# Altium project radioboard.PrjPcb (part 3 of 3)

## Sheet STM32_microcontroller_RF.SchDoc: STM32 microcontroller RF
size A3; Date: Not used; ApprovedBy: Not used; CheckedBy: Not used; Author: Not used; CompanyName: STMicroelectronics; DrawnBy: Not used; Engineer: Not used; Organization: Not used; Address1: Not used; Address2: Not used; Address3: Not used; Address4: Not used; DocumentNumber: 5; Revision: Not used; SheetNumber: 5; SheetTotal: 8; CurrentTime: Not used; CurrentDate: Not used; Time: Not used; DocumentFullPathAndName: Not used; DocumentName: Not used; ModifiedDate: Not used; ImagePath: Not used; ProjectName: Not used; Application_BuildNumber: Not used
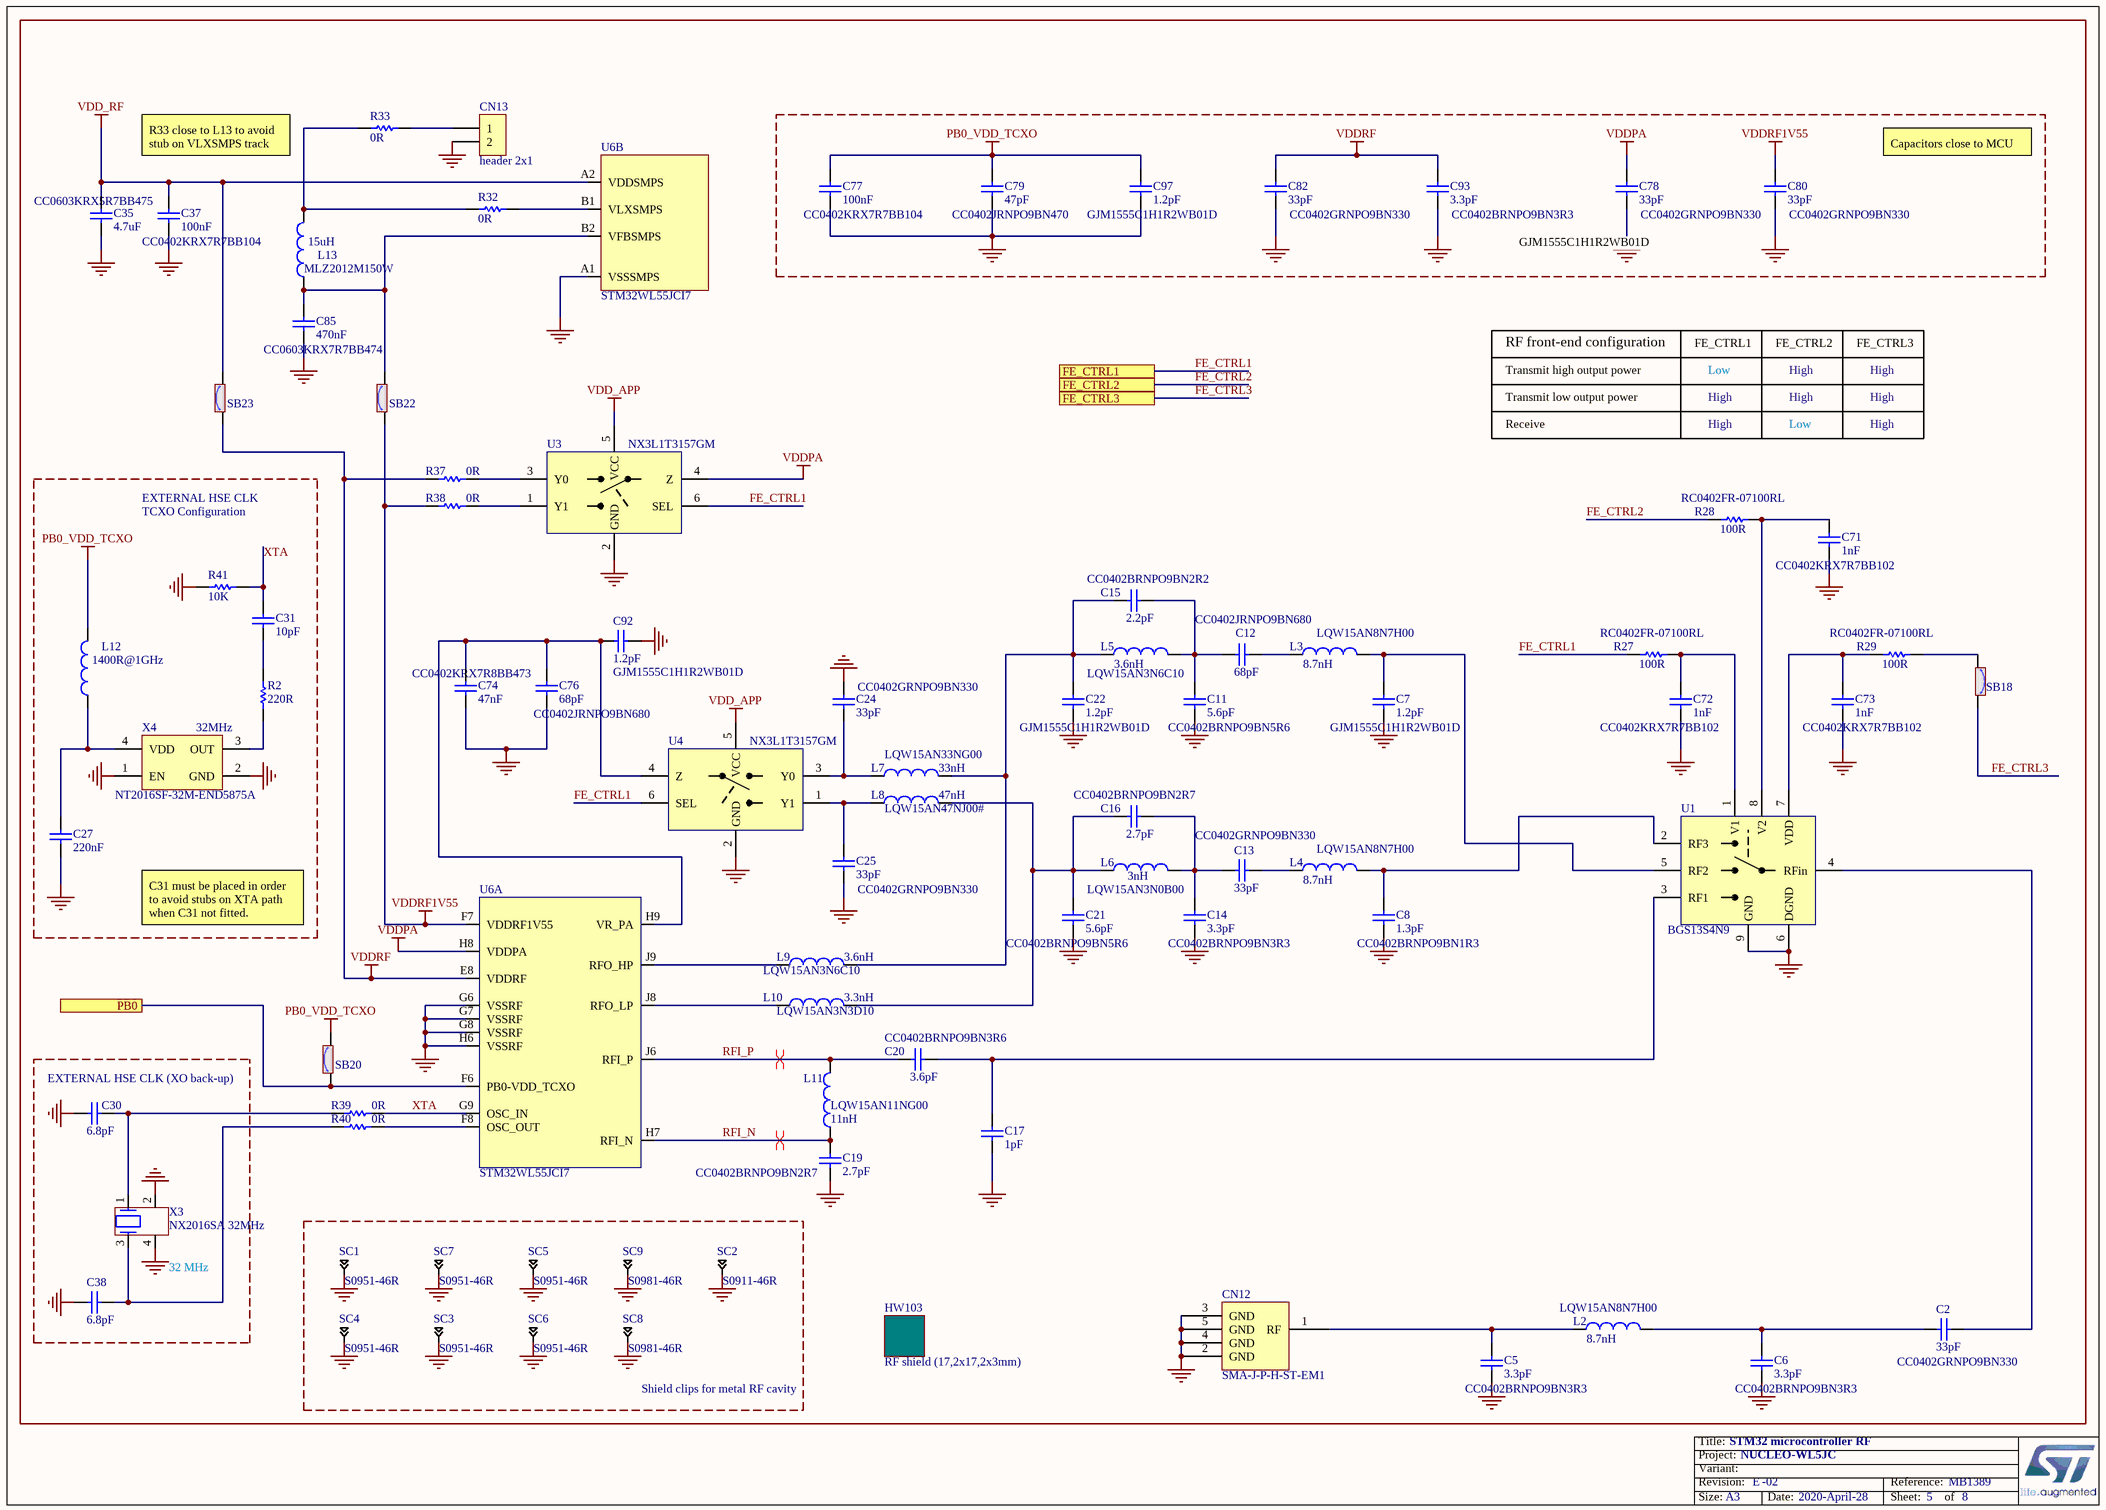
[diagram p6: STM32_microcontroller_RF.SchDoc]

### Parts
C2  value 33pF  Manufacturer_Part_Number: CC0402GRNPO9BN330  [C0402]
C5  value 3.3pF  Manufacturer_Part_Number: CC0402BRNPO9BN3R3  [C0402]
C6  value 3.3pF  Manufacturer_Part_Number: CC0402BRNPO9BN3R3  [C0402]
C7  value 1.2pF  Manufacturer_Part_Number: GJM1555C1H1R2WB01D  [C0402]  (hidden comment: Capacitor)
C8  value 1.3pF  Manufacturer_Part_Number: CC0402BRNPO9BN1R3  [C0402]
C11  value 5.6pF  Manufacturer_Part_Number: CC0402BRNPO9BN5R6  [C0402]  (hidden comment: Capacitor)
C12  value 68pF  Manufacturer_Part_Number: CC0402JRNPO9BN680  [C0402]  (hidden comment: Capacitor)
C13  value 33pF  Manufacturer_Part_Number: CC0402GRNPO9BN330  [C0402]
C14  value 3.3pF  Manufacturer_Part_Number: CC0402BRNPO9BN3R3  [C0402]
C15  value 2.2pF  Manufacturer_Part_Number: CC0402BRNPO9BN2R2  [C0402]  (hidden comment: Capacitor)
C16  value 2.7pF  Manufacturer_Part_Number: CC0402BRNPO9BN2R7  [C0402]
C17  value 1pF  [C0402]  (hidden comment: Capacitor)
C19  value 2.7pF  Manufacturer_Part_Number: CC0402BRNPO9BN2R7  [C0402]
C20  value 3.6pF  Manufacturer_Part_Number: CC0402BRNPO9BN3R6  [C0402]
C21  value 5.6pF  Manufacturer_Part_Number: CC0402BRNPO9BN5R6  [C0402]
C22  value 1.2pF  Manufacturer_Part_Number: GJM1555C1H1R2WB01D  [C0402]  (hidden comment: Capacitor)
C24  value 33pF  Manufacturer_Part_Number: CC0402GRNPO9BN330  [C0402]
C25  value 33pF  Manufacturer_Part_Number: CC0402GRNPO9BN330  [C0402]
C27  value 220nF  [C0402]  (hidden comment: Capacitor)
C30  value 6.8pF  [C0402]
C31  value 10pF  [C0402]  (hidden comment: Capacitor)
C35  value 4.7uF  Manufacturer_Part_Number: CC0603KRX5R7BB475  [C0603]
C37  value 100nF  Manufacturer_Part_Number: CC0402KRX7R7BB104  [C0402]
C38  value 6.8pF  [C0402]
C71  value 1nF  Manufacturer_Part_Number: CC0402KRX7R7BB102  [C0402]
C72  value 1nF  Manufacturer_Part_Number: CC0402KRX7R7BB102  [C0402]
C73  value 1nF  Manufacturer_Part_Number: CC0402KRX7R7BB102  [C0402]
C74  value 47nF  Manufacturer_Part_Number: CC0402KRX7R8BB473  [C0402]
C76  value 68pF  Manufacturer_Part_Number: CC0402JRNPO9BN680  [C0402]
C77  value 100nF  Manufacturer_Part_Number: CC0402KRX7R7BB104  [C0402]
C78  value 33pF  Manufacturer_Part_Number: CC0402GRNPO9BN330  [C0402]
C79  value 47pF  Manufacturer_Part_Number: CC0402JRNPO9BN470  [C0402]
C80  value 33pF  Manufacturer_Part_Number: CC0402GRNPO9BN330  [C0402]
C82  value 33pF  Manufacturer_Part_Number: CC0402GRNPO9BN330  [C0402]
C85  value 470nF  Manufacturer_Part_Number: CC0603KRX7R7BB474  [C0603]
C92  value 1.2pF  Manufacturer_Part_Number: GJM1555C1H1R2WB01D  [C0402]  (hidden comment: Capacitor)
C93  value 3.3pF  Manufacturer_Part_Number: CC0402BRNPO9BN3R3  [C0402]  (hidden comment: Capacitor)
C97  value 1.2pF  Manufacturer_Part_Number: GJM1555C1H1R2WB01D  [C0402]  (hidden comment: Capacitor)
CN12  value SMA-J-P-H-ST-EM1  [CON_SAMTEC_SMA-J-P-X-ST-EM1]
CN13  value header 2x1  [CON_988-JIUBABA_PHFS25-11-02-G0B115-T-1]
HW103  value RF shield (17,2x17,2x3mm)  [SHIELD_RF_ST-CUSTOM_17P2X17P2_H3]  (hidden comment: Daughter_Board)
L2  value 8.7nH  Manufacturer_Part_Number: LQW15AN8N7H00  [IND_0402_MURATA_LQW15AN_H0P5]
L3  value 8.7nH  Manufacturer_Part_Number: LQW15AN8N7H00  [IND_0402_MURATA_LQW15AN_H0P5]  (hidden comment: Inductor)
L4  value 8.7nH  Manufacturer_Part_Number: LQW15AN8N7H00  [IND_0402_MURATA_LQW15AN_H0P5]
L5  value 3.6nH  Manufacturer_Part_Number: LQW15AN3N6C10  [IND_0402_MURATA_LQW15AN_H0P5]  (hidden comment: Inductor)
L6  value 3nH  Manufacturer_Part_Number: LQW15AN3N0B00  [IND_0402_MURATA_LQW15AN_H0P5]  (hidden comment: Inductor)
L7  value 33nH  Manufacturer_Part_Number: LQW15AN33NG00  [IND_0402_MURATA_LQW15AN_H0P5]  (hidden comment: Inductor)
L8  value 47nH  Manufacturer_Part_Number: LQW15AN47NJ00#  [IND_0402_MURATA_LQW15AN2N4C00X]
L9  value 3.6nH  Manufacturer_Part_Number: LQW15AN3N6C10  [IND_0402_MURATA_LQW15AN_H0P5]
L10  value 3.3nH  Manufacturer_Part_Number: LQW15AN3N3D10  [IND_0402_MURATA_LQW15AN_H0P5]
L11  value 11nH  Manufacturer_Part_Number: LQW15AN11NG00  [IND_0402_MURATA_LQW15AN_H0P5]  (hidden comment: Inductor)
L12  value 1400R@1GHz  [IND_0402_MURATA_BLM15H_H0P5]
L13  value 15uH  Manufacturer_Part_Number: MLZ2012M150W  [IND_TDK_MLZ2012M150W]
R2  value 220R  [R0402]  (hidden comment: Resistor)
R27  value 100R  Manufacturer_Part_Number: RC0402FR-07100RL  [R0402]
R28  value 100R  Manufacturer_Part_Number: RC0402FR-07100RL  [R0402]
R29  value 100R  Manufacturer_Part_Number: RC0402FR-07100RL  [R0402]
R32  value 0R  [R0402]
R33  value 0R  [R0402]
R37  value 0R  [R0402]
R38  value 0R  [R0402]
R39  value 0R  [R0402]
R40  value 0R  [R0402]
R41  value 10K  [R0402]
SB18  (no value)  [SOLDER-BRIDGE_R0603-0R]
SB20  (no value)  [SOLDER-BRIDGE_R0603-0R]
SB22  (no value)  [SOLDER-BRIDGE_R0603-0R]
SB23  (no value)  [SOLDER-BRIDGE_R0603-0R]
SC1  value S0951-46R  [CLIP_HARWIN_S0951-46R]
SC2  value S0911-46R  (hidden comment: Shield-clip_S0951-46R)
SC3  value S0951-46R  [CLIP_HARWIN_S0951-46R]
SC4  value S0951-46R  [CLIP_HARWIN_S0951-46R]
SC5  value S0951-46R  [CLIP_HARWIN_S0951-46R]
SC6  value S0951-46R  [CLIP_HARWIN_S0951-46R]
SC7  value S0951-46R  [CLIP_HARWIN_S0951-46R]
SC8  value S0981-46R  (hidden comment: Shield-clip_S0981-46R)
SC9  value S0981-46R  (hidden comment: Shield-clip_S0981-46R)
U1  value BGS13S4N9  [ICC_TSNP-9-3_1P1X1P1_P040]
U3  value NX3L1T3157GM  [ICC_SOT886_XSON6]
U4  value NX3L1T3157GM  [ICC_SOT886_XSON6]
U6  value STM32WL55JCI7  [ICC_UFBGA73_5X5_P050]  (parts A,B of 5)
X3  value NX2016SA 32MHz  [CRY_NX2016SA_4P]
X4  value 32MHz  [CRY_NDK_NT2016SB_4P]  (hidden comment: NT2016SF)

### Blocks framed on the sheet
Shield clips for metal RF cavity: SC1-SC9

### Ports
FE_CTRL1, FE_CTRL2, FE_CTRL3, PB0

### Nets
GND: C5.1 C6.1 C7.1 C8.1 C11.1 C14.1 C17.1 C19.1 C21.1 C22.1 C24.2 C25.1 C27.1 C30.1 C35.1 C37.2 C38.1 C71.1 C72.1 C73.1 C74.1 C76.1 C77.2 C78.1 C79.1 C80.1 C82.1 C85.1 C92.1 C93.1 C97.1 CN12.2(GND) CN12.3(GND) CN12.4(GND) CN12.5(GND) CN13.2 R41.1 SC1.1 SC2.1 SC3.1 SC4.1 SC5.1 SC6.1 SC7.1 SC8.1 SC9.1 U1.6(DGND) U1.9(GND) U3.2(GND) U4.2(GND) U6.A1(VSSSMPS) U6.G6(VSSRF) U6.G7(VSSRF) U6.G8(VSSRF) U6.H6(VSSRF) X3.2 X3.4 X4.1(EN) X4.2(GND)
PB0_VDD_TCXO: C77.1 C79.2 C97.2 L12.2 SB20.2
VDD_APP: U3.5(VCC) U4.5(VCC)
VDD_RF: C35.2 C37.1 SB23.2 U6.A2(VDDSMPS)
VDDPA: C78.2 U3.4(Z) U6.H8(VDDPA)
VDDRF: C82.2 C93.2 R37.2 SB23.1 U6.E8(VDDRF)
VDDRF1V55: C80.2 R38.2 SB22.1 U6.F7(VDDRF1V55)
FE_CTRL1: R27.1 U3.6(SEL) U4.6(SEL) ; port FE_CTRL1
FE_CTRL2: R28.1 ; port FE_CTRL2
FE_CTRL3: SB18.2 ; port FE_CTRL3
PB0: SB20.1 U6.F6(PB0-VDD_TCXO) ; port PB0
RFI_N: C19.2 L11.1 U6.H7(RFI_N)
RFI_P: C20.1 L11.2 U6.J6(RFI_P)
XTA: C31.2 R39.1 R41.2 U6.G9(OSC_IN)
NetC2_1: C2.1 C6.2 L2.2
NetC2_2: C2.2 U1.4(RFin)
NetC5_2: C5.2 CN12.1(RF) L2.1
NetC7_2: C7.2 L3.2 U1.5(RF2)
NetC8_2: C8.2 L4.2 U1.2(RF3)
NetC11_2: C11.2 C12.1 C15.2 L5.2
NetC12_2: C12.2 L3.1
NetC13_1: C13.1 L4.1
NetC13_2: C13.2 C14.2 C16.1 L6.2
NetC15_1: C15.1 C22.2 L5.1 L7.2 L9.2
NetC16_2: C16.2 C21.2 L6.1 L8.2 L10.2
NetC17_2: C17.2 C20.2 U1.3(RF1)
NetC24_1: C24.1 L7.1 U4.3(Y0)
NetC25_2: C25.2 L8.1 U4.1(Y1)
NetC27_2: C27.2 L12.1 X4.4(VDD)
NetC30_2: C30.2 R39.2 X3.1
NetC31_1: C31.1 R2.2
NetC38_2: C38.2 R40.2 X3.3
NetC71_2: C71.2 R28.2 U1.8(V2)
NetC72_2: C72.2 R27.2 U1.1(V1)
NetC73_2: C73.2 R29.1 U1.7(VDD)
NetC74_2: C74.2 C76.2 C92.2 U4.4(Z) U6.H9(VR_PA)
NetC85_2: C85.2 L13.1 SB22.2 U6.B2(VFBSMPS)
NetCN13_1: CN13.1 R33.1
NetL9_1: L9.1 U6.J9(RFO_HP)
NetL10_1: L10.1 U6.J8(RFO_LP)
NetL13_2: L13.2 R32.2 R33.2
NetR2_1: R2.1 X4.3(OUT)
NetR29_2: R29.2 SB18.1
NetR32_1: R32.1 U6.B1(VLXSMPS)
NetR37_1: R37.1 U3.3(Y0)
NetR38_1: R38.1 U3.1(Y1)
NetR40_1: R40.1 U6.F8(OSC_OUT)

### Layout directives
differential pair: RFI_N, RFI_P

### Notes on the sheet
- R33 close to L13 to avoid stub on VLXSMPS track
- Capacitors close to MCU
- (near C78) GJM1555C1H1R2WB01D
- RF front-end configuration
- Transmit high output power
- FE_CTRL1
- Low
- FE_CTRL2
- High
- FE_CTRL3
- Transmit low output power
- Receive
- TCXO Configuration
- EXTERNAL HSE CLK
- C31 must be placed in order to avoid stubs on XTA path when C31 not fitted.
- (near C30) EXTERNAL HSE CLK (XO back-up)
- (near X3) 32 MHz
- Title:
- Project:
- Size:
- Revision:
- Variant:
- A3
- -
- Date:
- Reference:
- Sheet:
- of

### Library data of the parts
C2 C13 C24 C25 C78 C80 C82 = MCD-01784: Capacitor, MLCC, 33pF, 50V, NPO, +/-2%, 0402, T=0,5mm; Manufacturer: YAGEO; Provided_By: SUBCO; Internal_Part_Number: MCD-01784; Status: Checked; Part_Type: Capacitor; Package: C0402; ComponentLink1Description: Datasheet; ComponentLink1URL: http://tunmcdsvn.tun.st.com/Component_Datasheet_Library/Trunk/Capacitors/Yageo_Capacitor_NP0_16V-to-50V; ECCN_US: n/a; ECCN_EU: n/a
C5 C6 C14 = MCD-01775: Capacitor, MLCC, 3.3pF, 50V, NPO, +/-0.1pF, 0402, T=0,5mm; Manufacturer: YAGEO; Provided_By: SUBCO; Internal_Part_Number: MCD-01775; Status: Checked; Part_Type: Capacitor; Package: C0402; ComponentLink1Description: Datasheet; ComponentLink1URL: http://tunmcdsvn.tun.st.com/Component_Datasheet_Library/Trunk/Capacitors/Yageo_Capacitor_NP0_16V-to-50V; ECCN_US: n/a; ECCN_EU: n/a
C7 C22 C92 C97 = MCD-02065: Capacitor, High Q type for high frequency and high power, SMD, 1.2pF, 50V, 0,05pf, 0402; Part_Preference: Recommended; Manufacturer: MURATA; Order_Code_RS: 846-7246; Internal_Part_Number: MCD-02065; BMS_Part_Number: N/A; Status: Checked; Part_Type: Capacitor; Alternate_Manufacturer: N/A; Alternate_Manufacturer_Part_Number: N/A; Package: C0402; ComponentLink1Description: Datasheet; ComponentLink1URL: http://tunmcdsvn.tun.st.com/Component_Datasheet_Library/Trunk/Capacitors/MURATA_Chip_Monolithic_Ceramic_Capacitors; Order_Code_Digikey: 490-11195-2-ND; Order_Code_Farnell: 2781428
C8 = MCD-01772: Capacitor, MLCC, 1.3pF, 50V, NPO, +/-0.1pF, 0402, T=0,5mm; Manufacturer: YAGEO; Provided_By: SUBCO; Internal_Part_Number: MCD-01772; Status: Checked; Part_Type: Capacitor; Package: C0402; ComponentLink1Description: Datasheet; ComponentLink1URL: http://tunmcdsvn.tun.st.com/Component_Datasheet_Library/Trunk/Capacitors/Yageo_Capacitor_NP0_16V-to-50V; ECCN_US: n/a; ECCN_EU: n/a
C11 = MCD-01374: Capacitor, MLCC, 5.6pF, 50V, NPO, +/- 0.1pF, 0402, T=0,5mm; Part_Preference: Recommended; Manufacturer: YAGEO; Internal_Part_Number: MCD-01374; Status: Released; Part_Type: Capacitor; Package: C0402; ComponentLink1Description: Datasheet; ComponentLink1URL: http://tunmcdsvn.tun.st.com/Component_Datasheet_Library/Trunk/Capacitors/Yageo_Capacitor_NP0_16V-to-50V; Order_Code_Digikey: 311-1625-1-ND; Order_Code_Farnell: N/A; Order_Code_RS: N/A
C12 = MCD-01604: Capacitor, MLCC, 68pF, 50V, NPO, +/-5%, 0402, T=0,5mm; Part_Preference: Recommended; Manufacturer: YAGEO; Internal_Part_Number: MCD-01604; Status: Released; Part_Type: Capacitor; Package: C0402; ComponentLink1Description: Datasheet; ComponentLink1URL: http://tunmcdsvn.tun.st.com/Component_Datasheet_Library/Trunk/Capacitors/Yageo_Capacitor_NP0_16V-to-50V; Order_Code_Digikey: 311-1340-1-ND; Order_Code_Farnell: 3019214; Order_Code_RS: N/A
C15 = MCD-01773: Capacitor, MLCC, 2.2pF, 50V, NPO, +/-0.1pF, 0402, T=0,5mm; Part_Preference: Recommended; Manufacturer: YAGEO; Internal_Part_Number: MCD-01773; Status: Released; Part_Type: Capacitor; Package: C0402; ComponentLink1Description: Datasheet; ComponentLink1URL: http://tunmcdsvn.tun.st.com/Component_Datasheet_Library/Trunk/Capacitors/Yageo_Capacitor_NP0_16V-to-50V; Order_Code_Digikey: 311-1618-1-ND; Order_Code_Farnell: N/A; Order_Code_RS: N/A
C16 C19 = MCD-01774: Capacitor, MLCC, 2.7pF, 50V, NPO, +/-0.1pF, 0402, T=0,5mm; Manufacturer: YAGEO; Provided_By: SUBCO; Internal_Part_Number: MCD-01774; Status: Checked; Part_Type: Capacitor; Package: C0402; ComponentLink1Description: Datasheet; ComponentLink1URL: http://tunmcdsvn.tun.st.com/Component_Datasheet_Library/Trunk/Capacitors/Yageo_Capacitor_NP0_16V-to-50V; ECCN_US: n/a; ECCN_EU: n/a
C17 = MCD-01600: Capacitor, MLCC, 1pF, 50V, NPO, +/-0.1pF, 0402, T=0,5mm; Part_Preference: Recommended; Manufacturer: YAGEO; Manufacturer_Part_Number: CC0402BRNPO9BN1R0; Internal_Part_Number: MCD-01600; Status: Released; Part_Type: Capacitor; Package: C0402; ComponentLink1Description: Datasheet; ComponentLink1URL: http://tunmcdsvn.tun.st.com/Component_Datasheet_Library/Trunk/Capacitors/Yageo_Capacitor_NP0_16V-to-50V; Order_Code_Digikey: 311-3613-1-ND; Order_Code_Farnell: N/A; Order_Code_RS: N/A
C20 = MCD-01776: Capacitor, MLCC, 3.6pF, 50V, NPO, +/-0.1pF, 0402, T=0,5mm; Manufacturer: YAGEO; Provided_By: SUBCO; Internal_Part_Number: MCD-01776; Status: Checked; Part_Type: Capacitor; Package: C0402; ComponentLink1Description: Datasheet; ComponentLink1URL: http://tunmcdsvn.tun.st.com/Component_Datasheet_Library/Trunk/Capacitors/Yageo_Capacitor_NP0_16V-to-50V; ECCN_US: n/a; ECCN_EU: n/a
C21 = MCD-01374: Capacitor, MLCC, 5.6pF, 50V, NPO, +/- 0.1pF, 0402, T=0,5mm; Manufacturer: YAGEO; Provided_By: SUBCO; Internal_Part_Number: MCD-01374; Status: Released; Part_Type: Capacitor; Package: C0402; ComponentLink1Description: Datasheet; ComponentLink1URL: http://tunmcdsvn.tun.st.com/Component_Datasheet_Library/Trunk/Capacitors/Yageo_Capacitor_NP0_16V-to-50V; ECCN_US: N/A; ECCN_EU: N/A
C27 = MCD-00602: Capacitor, MLCC, 220nF, 16V, X7R, +/-10%, ,0402, T=0,5mm; Part_Preference: Recommended; Manufacturer: TDK; Manufacturer_Part_Number: C1005X7R1C224K050BE; Internal_Part_Number: MCD-00602; Status: Released; Part_Type: Capacitor; Package: C0402; ComponentLink1URL: http://tunmcdsvn.tun.st.com/Component_Datasheet_Library/Trunk/Capacitors/TDK_C1005X7R1C224K050BE/TDK_C1005X7R1C224K050BE.pdf; Order_Code_Digikey: 445-173638-1-ND; Order_Code_Farnell: N/A; Order_Code_RS: N/A
C30 C38 = MCD-00674: Capacitor, MLCC, 6.8pF, 50V, NPO, +-0.25pF, 0402, T=0.5mm; Manufacturer_Part_Number: CC0402CRNPO9BN6R8; Manufacturer: YAGEO; Provided_By: SUBCO; Internal_Part_Number: MCD-00674; Status: Released; Part_Type: Capacitor; Package: C0402; ComponentLink1Description: Datasheet; ComponentLink1URL: http://tunmcdsvn.tun.st.com/Component_Datasheet_Library/Trunk/Capacitors/Yageo_Capacitor_NP0_16V-to-50V; ECCN_US: N/A; ECCN_EU: N/A
C31 = MCD-00015: Capacitor, MLCC, 10pF, 50V, NPO, +/-5%, 0402, T=0,5mm; Part_Preference: Recommended; Manufacturer: YAGEO; Manufacturer_Part_Number: CC0402JRNPO9BN100; Internal_Part_Number: MCD-00015; Status: Released; Part_Type: Capacitor; Package: C0402; ComponentLink1Description: Datasheet; ComponentLink1URL: http://tunmcdsvn.tun.st.com/Component_Datasheet_Library/Trunk/Capacitors/Yageo_Capacitor_NP0_16V-to-50V
C35 = MCD-00009: Capacitor, MLCC, 4.7uF, 16V, X5R, 10%, 0603, T=0.8mm; Manufacturer: YAGEO; Provided_By: SUBCO; ECCN_US: EAR99; ECCN_EU: NEC; Internal_Part_Number: MCD-00009; ComponentLink1Description: Datasheet; Status: Released; Part_Type: Capacitor; Package: C0603; ComponentLink1URL: http://tunmcdsvn.tun.st.com/Component_Datasheet_Library/Trunk/Capacitors/Yageo_Multilayer_capacitor_X5R_series_100pF_to_100uF
C37 C77 = MCD-00102: Capacitor, MLCC, 100nF, 16V, X7R, 10%, 0402, T=0,5mm; Manufacturer: YAGEO; Alternate_Manufacturer_Part_Number: GCM155R71C104KA55D; Alternate_Manufacturer: MURATA; Provided_By: SUBCO; ECCN_US: EAR99; ECCN_EU: NEC; Internal_Part_Number: MCD-00102; Status: Released; Package: C0402; ComponentLink1Description: Datasheet; Part_Type: Capacitor; ComponentLink1URL: http://tunmcdsvn.tun.st.com/Component_Datasheet_Library/Trunk/Capacitors/Yageo_Multilayer_Capacitor_X7R_series_100pF_to_22uF
C71-C73 = MCD-00198: Capacitor, MLCC, 1nF, 16V, X7R, 10%, 0402, T=0.5mm; Manufacturer: YAGEO; Provided_By: SUBCO; ECCN_US: EAR99; ECCN_EU: NEC; Internal_Part_Number: MCD-00198; Status: Released; Part_Type: Capacitor; Package: C0402; ComponentLink1Description: Datasheet; ComponentLink1URL: http://tunmcdsvn.tun.st.com/Component_Datasheet_Library/Trunk/Capacitors/Yageo_Multilayer_Capacitor_X7R_series_100pF_to_22uF
C74 = MCD-01605: Capacitor, MLCC, 47nF, 25V, X7R, +-10%, 0402, T=0,5mm; Manufacturer: YAGEO; Provided_By: SUBCO; Internal_Part_Number: MCD-01605; Status: Footprint available; Part_Type: Capacitor; Package: C0402; ComponentLink1Description: Datasheet; ComponentLink1URL: http://tunmcdsvn.tun.st.com/Component_Datasheet_Library/Trunk/Capacitors/Yageo_Multilayer_Capacitor_X7R_series_100pF_to_22uF; ECCN_US: N/A; ECCN_EU: N/A
C76 = MCD-01604: Capacitor, MLCC, 68pF, 50V, NPO, +-5%, 0402, T=0,5mm; Manufacturer: YAGEO; Provided_By: SUBCO; Internal_Part_Number: MCD-01604; Status: Released; Part_Type: Capacitor; Package: C0402; ComponentLink1Description: Datasheet; ComponentLink1URL: http://tunmcdsvn.tun.st.com/Component_Datasheet_Library/Trunk/Capacitors/Yageo_Capacitor_NP0_16V-to-50V; ECCN_US: N/A; ECCN_EU: N/A
C79 = MCD-01603: Capacitor, MLCC, 147pF, 50V, NPO, +-5%, 0402, T=0,5mm; Manufacturer: YAGEO; Provided_By: SUBCO; Internal_Part_Number: MCD-01603; Status: Released; Part_Type: Capacitor; Package: C0402; ComponentLink1Description: Datasheet; ComponentLink1URL: http://tunmcdsvn.tun.st.com/Component_Datasheet_Library/Trunk/Capacitors/Yageo_Capacitor_NP0_16V-to-50V; ECCN_US: N/A; ECCN_EU: N/A
C85 = MCD-01006: Capacitor, MLCC, 470nF, 16V, X7R, 10%, 0603, T=0.8mm; Manufacturer: YAGEO; Provided_By: SUBCO; Internal_Part_Number: MCD-01006; Status: Released; Part_Type: Capacitor; Package: C0603; ComponentLink1Description: Datasheet; ComponentLink1URL: http://tunmcdsvn.tun.st.com/Component_Datasheet_Library/Trunk/Capacitors/Yageo_Multilayer_Capacitor_X7R_series_100pF_to_22uF/; ECCN_US: N/A; ECCN_EU: N/A
C93 = MCD-01775: Capacitor, MLCC, 3.3pF, 50V, NPO, +/-0.1pF, 0402, T=0,5mm; Part_Preference: Recommended; Manufacturer: YAGEO; Internal_Part_Number: MCD-01775; Status: Released; Part_Type: Capacitor; Package: C0402; ComponentLink1Description: Datasheet; ComponentLink1URL: http://tunmcdsvn.tun.st.com/Component_Datasheet_Library/Trunk/Capacitors/Yageo_Capacitor_NP0_16V-to-50V; Order_Code_Digikey: 311-1621-1-ND; Order_Code_Farnell: N/A; Order_Code_RS: N/A
CN12 = MCD-00279: RF SMA connector PCB edge; Manufacturer: SAMTEC; Provided_By: SUBCO; ECCN_US: EAR99; ECCN_EU: NEC; Internal_Part_Number: MCD-00279; Status: Released; Part_Type: Connector; Manufacturer_Part_Number: SMA-J-P-H-ST-EM1; ComponentLink1Description: Datasheet; ComponentLink1URL: http://tunmcdsvn.tun.st.com/Component_Datasheet_Library/Trunk/Connectors/Samtec_sma_SMA_series
CN13 = MCD-00314: Header, 2x1, 2.54mm, VR, TH, Height 6mm/3mm; Part_Type: Connector; Manufacturer_Part_Number: PHFS25-11-02-G0B115-T-1; Manufacturer: JIUBABA; Provided_By: SUBCO; Internal_Part_Number: MCD-00314; Status: Released; ComponentLink1Description: Datasheet; ComponentLink1URL: http://tunmcdsvn.tun.st.com/Component_Datasheet_Library/Trunk/Connectors/Jiubaba_PHFS25_11XXXXXXXXXX; ECCN_US: n/a; ECCN_EU: n/a
HW103 = MCD-02088: RF shield (17,2x17,2x3mm), Brass with Sn finishing, Sheet tickness : 0,2mm; BMS_Part_Number: TBD; Part_Preference: Recommended; Part_Type: Misc; Internal_Part_Number: MCD-02088; Status: Checked; Manufacturer: TBD; Manufacturer_Part_Number: RF shield (17,2x17,2x3mm); Alternate_Manufacturer: N/A; Alternate_Manufacturer_Part_Number: N/A; Package: N/A; ComponentLink1Description: Datasheet; ComponentLink1URL: http://tunmcdsvn.tun.st.com/Component_Datasheet_Library/Trunk/Misc/RF shielded box (17,2x17,2x3mm); Order_Code_Digikey: N/A; Order_Code_Farnell: N/A; Order_Code_RS: N/A
L2 L4 = MCD-01768: 0402 inductor, 8.7nH +/-3%, 540mA max, 0.14 ohm DC max, Q min = 25; Manufacturer: MURATA; Provided_By: SUBCO; Internal_Part_Number: MCD-01768; Status: Checked; Part_Type: Inductor; Package: L0402; ComponentLink1Description: Datasheet; ComponentLink1URL: http://tunmcdsvn.tun.st.com/Component_Datasheet_Library/Trunk/Inductors/Murata_inductor_LQW15ANseries; ECCN_US: n/a; ECCN_EU: n/a
L3 = MCD-01768: 0402 inductor, 8.7nH +/-3%, 540mA max, 0.14 ohm DC max, Q min = 25; Part_Preference: Recommended; Manufacturer: MURATA; Internal_Part_Number: MCD-01768; Status: Released; Part_Type: Inductor; Package: L0402; ComponentLink1Description: Datasheet; ComponentLink1URL: http://tunmcdsvn.tun.st.com/Component_Datasheet_Library/Trunk/Inductors/Murata_inductor_LQW15ANseries
L5 = MCD-01762: 0402 inductor, 3.6nH +/-0.2nH, 900mA max, 0.04 ohm DC max, Q min = 30; Part_Preference: Recommended; Manufacturer: MURATA; Internal_Part_Number: MCD-01762; Status: Released; Part_Type: Inductor; Package: L0402; ComponentLink1Description: Datasheet; ComponentLink1URL: http://tunmcdsvn.tun.st.com/Component_Datasheet_Library/Trunk/Inductors/Murata_inductor_LQW15ANseries
L6 = MCD-01922: 0402 inductor, 3nH +-0.1nH, 750mA max, 0.07 ohm DC max, Q min = 20; Manufacturer: MURATA; Provided_By: SUBCO; Internal_Part_Number: MCD-01922; Status: Footprint available; Part_Type: Inductor; Package: L0402; ComponentLink1Description: Datasheet; ComponentLink1URL: http://tunmcdsvn.tun.st.com/Component_Datasheet_Library/Trunk/Inductors/Murata_inductor_LQW15ANseries; ECCN_US: n/a; ECCN_EU: n/a
L7 = MCD-02069: Inductor, 33nH +/-2%, 260mA max , 0.63 ohm DC max, 0402, Q min = 25.; Part_Preference: Recommended; Manufacturer: MURATA; Order_Code_RS: 169-2777; Internal_Part_Number: MCD-02069; BMS_Part_Number: N/A; Status: Released; Part_Type: Inductor; Alternate_Manufacturer: N/A; Alternate_Manufacturer_Part_Number: N/A; Package: L0402; ComponentLink1Description: Datasheet; ComponentLink1URL: http://tunmcdsvn.tun.st.com/Component_Datasheet_Library/Trunk/Inductors/Murata_inductor_LQW15ANseries; Order_Code_Digikey: 490-6804-1-ND; Order_Code_Farnell: 1762626
L8 = MCD-01609: Inductor, 47nH, +-5%, 210mA, 1.08ohm DC max, 0402; Manufacturer: MURATA; Provided_By: SUBCO; Internal_Part_Number: MCD-01609; Status: Footprint available; Part_Type: Inductor; Package: L0402; ComponentLink1Description: Datasheet; ComponentLink1URL: http://tunmcdsvn.tun.st.com/Component_Datasheet_Library/Trunk/Inductors/Murata_inductor_LQW15ANseries/; ECCN_US: n/a; ECCN_EU: n/a
L9 = MCD-01762: 0402 inductor, 3.6nH +/-0.2nH, 900mA max, 0.04 ohm DC max, Q min = 30; Manufacturer: MURATA; Provided_By: SUBCO; Internal_Part_Number: MCD-01762; Status: Checked; Part_Type: Inductor; Package: L0402; ComponentLink1Description: Datasheet; ComponentLink1URL: http://tunmcdsvn.tun.st.com/Component_Datasheet_Library/Trunk/Inductors/Murata_inductor_LQW15ANseries; ECCN_US: n/a; ECCN_EU: n/a
L10 = MCD-01761: 0402 inductor, 3.3nH +-0.5nH, 900mA max, 0.04 ohm DC max, Q min = 30; Manufacturer: MURATA; Provided_By: SUBCO; Internal_Part_Number: MCD-01761; Status: Checked; Part_Type: Inductor; Package: L0402; ComponentLink1Description: Datasheet; ComponentLink1URL: http://tunmcdsvn.tun.st.com/Component_Datasheet_Library/Trunk/Inductors/Murata_inductor_LQW15ANseries; ECCN_US: n/a; ECCN_EU: n/a
L11 = MCD-01921: 0402 inductor, 11nH +-2%, 500mA max, 0.14 ohm DC max, Q min = 30; Manufacturer: MURATA; Provided_By: SUBCO; Internal_Part_Number: MCD-01921; Status: Footprint available; Part_Type: Inductor; Package: L0402; ComponentLink1Description: Datasheet; ComponentLink1URL: http://tunmcdsvn.tun.st.com/Component_Datasheet_Library/Trunk/Inductors/Murata_inductor_LQW15ANseries; ECCN_US: n/a; ECCN_EU: n/a
L12 = MCD-01610: ferrite bead, 1400ohms at 1GHz, 250mA, 1.1ohms DC max; Manufacturer_Part_Number: BLM15HG102SN1#; Manufacturer: MURATA; Provided_By: SUBCO; Internal_Part_Number: MCD-01610; Status: Footprint available; Part_Type: Inductor; Package: L0402; ComponentLink1Description: Datasheet; ComponentLink1URL: http://tunmcdsvn.tun.st.com/Component_Datasheet_Library/Trunk/Inductors/Murata_ferrite-bead_BLM15series; ECCN_US: n/a; ECCN_EU: n/a
L13 = MCD-01433: MLZ2012 Multilayer Shielded Inductor 15uH, +/-5%; Manufacturer: TDK; Provided_By: SUBCO; Internal_Part_Number: MCD-01433; Status: Checked; Part_Type: Inductor; Package: L0805; ComponentLink1Description: Datasheet; ComponentLink1URL: http://tunmcdsvn.tun.st.com/Component_Datasheet_Library/Trunk/Inductors/TDK_Inductor_MLZ2012%20series/; ECCN_US: n/a; ECCN_EU: n/a
R2 = MCD-00427: Resistor,220R,0402,1%,1/16W; Manufacturer_Part_Number: RC0402FR-07220RL; Manufacturer: YAGEO; ECCN_US: EAR99; ECCN_EU: NEC; Provided_By: SUBCO; Internal_Part_Number: MCD-00427; Status: Released; Part_Type: Resistor; Package: R0402; ComponentLink1Description: Datasheet; ComponentLink1URL: http://tunmcdsvn.tun.st.com/Component_Datasheet_Library/Trunk/Resistors/Yageo_Resistor_RC0402-series
R27-R29 = MCD-00119: Resistor,100R,0402,1%,1/16W; Manufacturer: YAGEO; Provided_By: SUBCO; ECCN_US: EAR99; ECCN_EU: NEC; Internal_Part_Number: MCD-00119; Status: Released; Part_Type: Resistor; Package: R0402; ComponentLink1Description: Datasheet; ComponentLink1URL: http://tunmcdsvn.tun.st.com/Component_Datasheet_Library/Trunk/Resistors/Yageo_Resistor_RC0402-series
R32 R33 R37-R40 = MCD-00052: Resistor,0R,0402,5%,1/16W; Manufacturer_Part_Number: RC0402JR-070RL; Manufacturer: YAGEO; Provided_By: SUBCO; ECCN_US: EAR99; ECCN_EU: NEC; Internal_Part_Number: MCD-00052; Status: Released; Part_Type: Resistor; Package: R0402; ComponentLink1Description: Datasheet; ComponentLink1URL: http://tunmcdsvn.tun.st.com/Component_Datasheet_Library/Trunk/Resistors/Yageo_Resistor_RC0402-series
R41 = MCD-00053: Resistor,10K,0402,1%,1/16W; Manufacturer_Part_Number: RC0402FR-0710KL; Manufacturer: YAGEO; BMS_Part_Number: 9131590; ECCN_US: EAR99; ECCN_EU: NEC; Provided_By: SUBCO; Internal_Part_Number: MCD-00053; Status: Released; Part_Type: Resistor; Package: R0402; ComponentLink1Description: Datasheet; ComponentLink1URL: http://tunmcdsvn.tun.st.com/Component_Datasheet_Library/Trunk/Resistors/Yageo_Resistor_RC0402-series
SB18 SB20 SB22 SB23 = MCD-00071: Solder Bridge ON; Part_Type: Mechanical; Manufacturer_Part_Number: RC0603JR-070RL; Manufacturer: YAGEO; Provided_By: SUBCO; Internal_Part_Number: MCD-00071; Status: Released; Package: SB0603; ComponentLink1Description: Datasheet; ComponentLink1URL: http://tunmcdsvn.tun.st.com/Component_Datasheet_Library/Trunk/Resistors/Yageo_Resistor_RC0603-series; ECCN_US: n/a; ECCN_EU: n/a
SC1 SC3-SC7 = MCD-01587: shield clip Harwin S0951-46R to fix RF shielded cavity; Part_Type: Connector; ECCN_US: tbd; Provided_By: SUBCO; Internal_Part_Number: MCD-01587; Status: Footprint available; Manufacturer_Part_Number: S0951-46R; Manufacturer: HARWIN; Package: na; ComponentLink1Description: Datasheet; ComponentLink1URL: http://tunmcdsvn.tun.st.com/Component_Datasheet_Library/Trunk/Connectors/Harwin_Shield-clip_S0951-46R; ECCN_EU: tbd
SC2 = MCD-02165: shield clip Harwin S0911-46R to fix RF shielded cavity - SMT RFI Shield Clip, Compact (T+R); Part_Type: Misc; Provided_By: SUBCO; PCB_Footprint_Ref1: CLIP_HARWIN_S0911-46R; Internal_Part_Number: MCD-02165; Status: Checked; Manufacturer_Part_Number: S0911-46R; Manufacturer: HARWIN; Alternate_Manufacturer_Part_Number: N/A; Alternate_Manufacturer: N/A; ComponentLink1Description: Datasheet; ComponentLink1URL: http://tunmcdsvn.tun.st.com/Component_Datasheet_Library/Trunk/Connectors/Harwin_Shield-clip_S0911-46R; Order_Code_Digikey: 952-4312-1-ND; Order_Code_Farnell: 3104143; Order_Code_RS: N/A
SC8 SC9 = MCD-02164: shield clip Harwin S0981-46R to fix RF shielded cavity - SMT RFI Shield Clip, Corner (T+R); Part_Type: Misc; Order_Code_RS: 161-3702; Provided_By: SUBCO; PCB_Footprint_Ref1: CLIP_HARWIN_S0981-46R; Internal_Part_Number: MCD-02164; Status: Checked; Manufacturer_Part_Number: S0981-46R; Manufacturer: HARWIN; Alternate_Manufacturer_Part_Number: N/A; Alternate_Manufacturer: N/A; ComponentLink1Description: Datasheet; ComponentLink1URL: http://tunmcdsvn.tun.st.com/Component_Datasheet_Library/Trunk/Connectors/Harwin_Shield-clip_S0981-46R; Order_Code_Digikey: 952-2518-1-ND; Order_Code_Farnell: 2361678
U1 = MCD-02018: Wideband RF SP3T Switch; Part_Type: IC; Manufacturer: INFINEON; ECCN_US: EAR99; ECCN_EU: tbd; Provided_By: SUBCO; Internal_Part_Number: MCD-02018; Status: Checked; Manufacturer_Part_Number: BGS13S4N9; Package: TSNP-9-3; ComponentLink1Description: Datasheet; ComponentLink1URL: http://tunmcdsvn.tun.st.com/Component_Datasheet_Library/Trunk/IC/Infineon_SP3T_BGS13S4N9/Infineon-BGS13S4N9-DS-v01_00-EN.pdf
U3 U4 = MCD-01514: DC switch - Ultra-Low 0.5ohm  SPDT analog switch; Part_Type: IC; Manufacturer: NXP; Provided_By: SUBCO; ECCN_US: EAR99; ECCN_EU: NEC; Internal_Part_Number: MCD-01514; Status: Footprint available; Manufacturer_Part_Number: NX3L1T3157GM; Package: SOT886; ComponentLink1Description: Datasheet; ComponentLink1URL: http://tunmcdsvn.tun.st.com/Component_Datasheet_Library/Trunk/IC/NXP_DCswitch_NX3L1T3157/
U6 = MCD-01435: Multiprotocol Wireless 32-bit MCUwith LPWAN Sub-GHz radio solution; Part_Type: IC; Manufacturer: STMICROELECTRONICS; ECCN_US: tbd; Internal_Part_Number: MCD-01435; Status: Footprint available; Manufacturer_Part_Number: STM32WL55JCI7; Package: UFBGA73; ComponentLink1Description: Datasheet; ComponentLink1URL: http://tunmcdsvn.tun.st.com/Component_Datasheet_Library/Trunk/IC/STM_STM32WL5x; Provided_By: n/a; ECCN_EU: tbd
X3 = MCD-01507: Crystal 32MHz, 10pF, +-10 ppm, 50ohm max, SMD; Part_Type: Crystal_Osc; Manufacturer_Part_Number: NX2016SA 32MHz EXS00A-CS06465; Manufacturer: NDK; Provided_By: SUBCO; ECCN_US: EAR99; ECCN_EU: NEC; Internal_Part_Number: MCD-01507; Status: Footprint available; Package: NX2016SA; ComponentLink1Description: Datasheet; ComponentLink1URL: http://tunmcdsvn.tun.st.com/Component_Datasheet_Library/Trunk/Crystal_Osc/NDK_NX2016SA 32MHz EXS00A-CS06465; Order_Code_Digikey: 644-1300
X4 = MCD-02240: NT2016SF-32M-END5875A; Part_Preference: Recommended; Part_Type: Crystal_Osc; Manufacturer: NDK; Internal_Part_Number: MCD-02240; Status: Checked; Manufacturer_Part_Number: NT2016SF-32M-END5875A; Alternate_Manufacturer: N/A; Alternate_Manufacturer_Part_Number: N/A; Package: 2016 size; ComponentLink1Description: Part_Information; ComponentLink1URL: http://tunmcdsvn.tun.st.com/Component_Datasheet_Library/Trunk/Crystal_Osc/NDK_NT2016SF%2032MHz%20END5875A%20(ETS10B-12472)/; Order_Code_Digikey: N/A; Order_Code_Farnell: N/A; Order_Code_RS: N/A

## Sheet STM32_microcontroller_power.SchDoc: STM32 microcontroller power
size A4; Date: Not used; ApprovedBy: Not used; CheckedBy: Not used; Author: Not used; CompanyName: STMicroelectronics; DrawnBy: Not used; Engineer: Not used; Organization: Not used; Address1: Not used; Address2: Not used; Address3: Not used; Address4: Not used; DocumentNumber: 4; Revision: Not used; SheetNumber: 4; SheetTotal: 8; CurrentTime: Not used; CurrentDate: Not used; Time: Not used; DocumentFullPathAndName: Not used; DocumentName: Not used; ModifiedDate: Not used; ImagePath: Not used; ProjectName: Not used; Application_BuildNumber: Not used
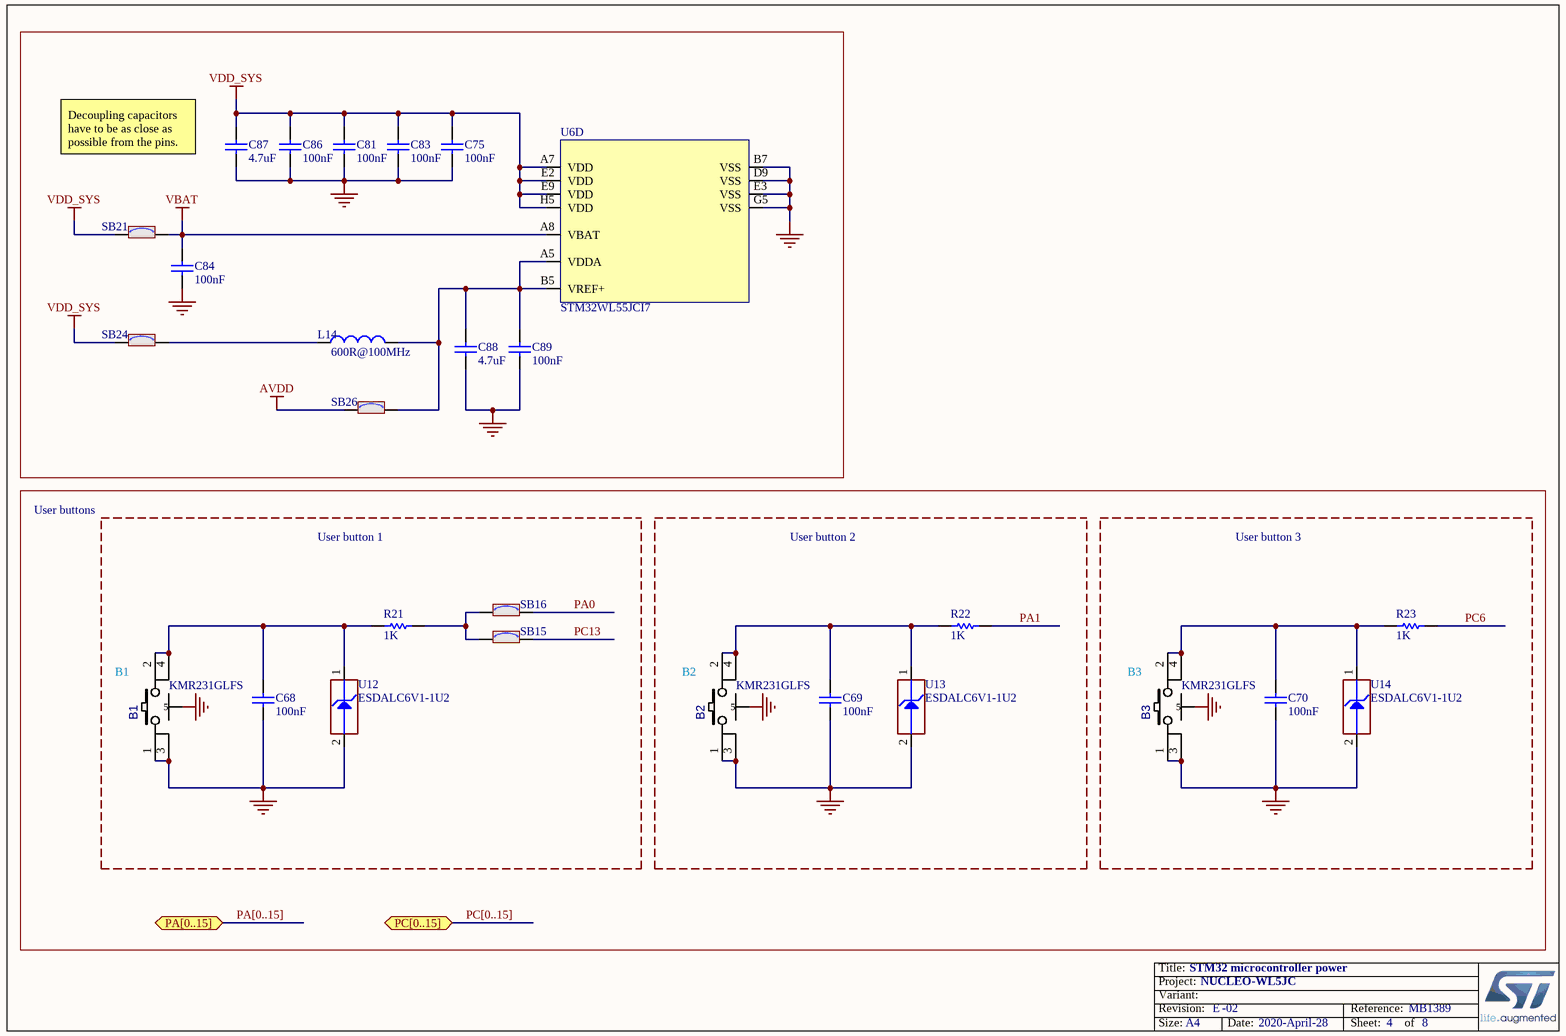
[diagram p7: STM32_microcontroller_power.SchDoc]

### Parts
B1  value KMR231GLFS  [SWI_C&K_Y78B23110FP__ITT_KMR231GLFS]
B2  value KMR231GLFS  [SWI_C&K_Y78B23110FP__ITT_KMR231GLFS]
B3  value KMR231GLFS  [SWI_C&K_Y78B23110FP__ITT_KMR231GLFS]
C68  value 100nF  [C0402]
C69  value 100nF  [C0402]
C70  value 100nF  [C0402]
C75  value 100nF  [C0402]
C81  value 100nF  [C0402]
C83  value 100nF  [C0402]
C84  value 100nF  [C0402]
C86  value 100nF  [C0402]
C87  value 4.7uF  [C0603]
C88  value 4.7uF  [C0603]
C89  value 100nF  [C0402]
L14  value 600R@100MHz  [L0603]
R21  value 1K  [R0402]
R22  value 1K  [R0402]
R23  value 1K  [R0402]
SB15  (no value)  [SOLDER-BRIDGE_R0603-0R]
SB16  (no value)  [SOLDER-BRIDGE_R0603-0R]
SB21  (no value)  [SOLDER-BRIDGE_R0603-0R]
SB24  (no value)  [SOLDER-BRIDGE_R0603-0R]
SB26  (no value)  [SOLDER-BRIDGE_R0603-0R]
U6  value STM32WL55JCI7  [ICC_UFBGA73_5X5_P050]  (part D of 5)
U12  value ESDALC6V1-1U2  [ESD_ST0201]
U13  value ESDALC6V1-1U2  [ESD_ST0201]
U14  value ESDALC6V1-1U2  [ESD_ST0201]

### Ports
PA[0..15] (bidir), PC[0..15] (bidir)

### Nets
AVDD: SB26.1
GND: B1.1 B1.3 B1.5 B2.1 B2.3 B2.5 B3.1 B3.3 B3.5 C68.1 C69.1 C70.1 C75.1 C81.1 C83.1 C84.1 C86.1 C87.1 C88.1 C89.1 U6.B7(VSS) U6.D9(VSS) U6.E3(VSS) U6.G5(VSS) U12.2(GND) U13.2(GND) U14.2(GND)
VBAT: C84.2 SB21.2 U6.A8(VBAT)
VDD_SYS: C75.2 C81.2 C83.2 C86.2 C87.2 SB21.1 SB24.1 U6.A7(VDD) U6.E2(VDD) U6.E9(VDD) U6.H5(VDD)
PA0: SB16.2
PA1: R22.2
PC6: R23.2
PC13: SB15.2
NetB1_2: B1.2 B1.4 C68.2 R21.1 U12.1(IO1)
NetB2_2: B2.2 B2.4 C69.2 R22.1 U13.1(IO1)
NetB3_2: B3.2 B3.4 C70.2 R23.1 U14.1(IO1)
NetC88_2: C88.2 C89.2 L14.2 SB26.2 U6.A5(VDDA) U6.B5(VREF+)
NetL14_1: L14.1 SB24.2
NetR21_2: R21.2 SB15.1 SB16.1

### Buses and harness runs
bus PA[0..15] = port PA[0..15]
bus PC[0..15] = port PC[0..15]

### Notes on the sheet
- (near C87) Decoupling capacitors have to be as close as possible from the pins.
- User buttons
- User button 1
- User button 2
- User button 3
- (near B1) B1
- (near B2) B2
- (near B3) B3
- Title:
- Project:
- Size:
- Revision:
- Variant:
- A4
- -
- Date:
- Reference:
- Sheet:
- of

### Library data of the parts
B1-B3 = MCD-01485: Microminiature Tact Switch for SMT - KMR 2 Series - 1.9 mm height; Part_Type: Misc; Manufacturer: C&K; Provided_By: SUBCO; Internal_Part_Number: MCD-01485; Status: Checked; Manufacturer_Part_Number: KMR231GLFS; ComponentLink1Description: Datasheet; ComponentLink1URL: http://tunmcdsvn.tun.st.com/Component_Datasheet_Library/Trunk/Misc/C&K_tactile_switch_KMR_series; ECCN_US: n/a; ECCN_EU: n/a
C68-C70 C75 C81 C83 C84 C86 C89 = MCD-00102: Capacitor, MLCC, 100nF, 16V, X7R, 10%, 0402, T=0,5mm; Manufacturer_Part_Number: CC0402KRX7R7BB104; Manufacturer: YAGEO; Alternate_Manufacturer_Part_Number: GCM155R71C104KA55D; Alternate_Manufacturer: MURATA; Provided_By: SUBCO; ECCN_US: EAR99; ECCN_EU: NEC; Internal_Part_Number: MCD-00102; Status: Released; Package: C0402; ComponentLink1Description: Datasheet; Part_Type: Capacitor; ComponentLink1URL: http://tunmcdsvn.tun.st.com/Component_Datasheet_Library/Trunk/Capacitors/Yageo_Multilayer_Capacitor_X7R_series_100pF_to_22uF
C87 C88 = MCD-00009: Capacitor, MLCC, 4.7uF, 16V, X5R, 10%, 0603, T=0.8mm; Manufacturer_Part_Number: CC0603KRX5R7BB475; Manufacturer: YAGEO; Provided_By: SUBCO; ECCN_US: EAR99; ECCN_EU: NEC; Internal_Part_Number: MCD-00009; ComponentLink1Description: Datasheet; Status: Released; Part_Type: Capacitor; Package: C0603; ComponentLink1URL: http://tunmcdsvn.tun.st.com/Component_Datasheet_Library/Trunk/Capacitors/Yageo_Multilayer_capacitor_X5R_series_100pF_to_100uF
L14 = MCD-00047: SMD Chip ferrite bead, 600R@100MHz +/-25%, 350mA, 500mohm DC, 0603, T=0.8mm; Part_Type: Inductor; Manufacturer_Part_Number: FCM1608KF-601T03; Manufacturer: TAI-TECH; Provided_By: SUBCO; Internal_Part_Number: MCD-00047; Status: Released; ComponentLink1Description: Datasheet; ComponentLink1URL: http://tunmcdsvn.tun.st.com/Component_Datasheet_Library/Trunk/Inductors/TaiTech_Bead_FCM1608_series; ECCN_US: n/a; ECCN_EU: n/a
R21-R23 = MCD-00061: Resistor,1K,0402,1%,1/16W; Manufacturer_Part_Number: RC0402FR-071KL; Manufacturer: YAGEO; Provided_By: SUBCO; ECCN_US: EAR99; ECCN_EU: NEC; Internal_Part_Number: MCD-00061; Status: Released; Part_Type: Resistor; Package: R0402; ComponentLink1Description: Datasheet; ComponentLink1URL: http://tunmcdsvn.tun.st.com/Component_Datasheet_Library/Trunk/Resistors/Yageo_Resistor_RC0402-series
SB15 SB16 SB21 SB24 SB26 = MCD-00071: as SB18 on sheet STM32_microcontroller_RF; Internal_Part_Number: MCD-00071; Status: Released; Package: SB0603; ComponentLink1Description: Datasheet; ComponentLink1URL: http://tunmcdsvn.tun.st.com/Component_Datasheet_Library/Trunk/Resistors/Yageo_Resistor_RC0603-series; ECCN_US: n/a; ECCN_EU: n/a
U6 = MCD-01435: as U6 on sheet STM32_microcontroller_RF; Internal_Part_Number: MCD-01435; Status: Footprint available; Manufacturer_Part_Number: STM32WL55JCI7; Package: UFBGA73; ComponentLink1Description: Datasheet; ComponentLink1URL: http://tunmcdsvn.tun.st.com/Component_Datasheet_Library/Trunk/IC/STM_STM32WL5x; Provided_By: n/a; ECCN_EU: tbd
U12-U14 = MCD-00170: ESD protection 6V1; Part_Type: Diode; Manufacturer: STMICROELECTRONICS; BMS_Part_Number: 9151132; Provided_By: SUBCO with ST control; ECCN_US: EAR99; ECCN_EU: NEC; Internal_Part_Number: MCD-00170; Status: Released; Manufacturer_Part_Number: ESDALC6V1-1U2; ComponentLink1Description: Datasheet; ComponentLink1URL: http://tunmcdsvn.tun.st.com/Component_Datasheet_Library/Trunk/Diodes/STM_ESD_ESDALC6V1-1U2

## Nets that join several sheets
3V3: STLink_V3E_Module (CN16.3), STLink_V3E_PWR (5 pins), Arduino_extension_connectors (CN6.4 CN7.16 SB25.1)
3V3_STLK: STLink_V3E_Module (7 pins), STLink_V3E_PWR (39 pins)
5V: STLink_V3E_PWR (11 pins), Arduino_extension_connectors (CN6.5 CN7.18)
5V_PWR: STLink_V3E_Module (R9.1), STLink_V3E_PWR (JP7.2 R24.1)
5V_USB_CHGR: STLink_V3E_Module (7 pins), STLink_V3E_PWR (D3.1 JP4.7), Arduino_extension_connectors (CN10.8)
5V_USB_STLK: STLink_V3E_Module (C34.2 U5.1), STLink_V3E_PWR (JP4.1)
5V_VIN: STLink_V3E_PWR (6 pins), Arduino_extension_connectors (R31.2)
AVDD: Arduino_extension_connectors (CN5.8 CN10.7), STM32_microcontroller_power (SB26.1)
E5V: STLink_V3E_PWR (D2.1 JP4.5), Arduino_extension_connectors (C94.2 CN7.6)
GND: STM32_microcontroller_IOs (12 pins), STLink_V3E_Module (31 pins), STLink_V3E_PWR (83 pins), Arduino_extension_connectors (12 pins), STM32_microcontroller_RF (59 pins), STM32_microcontroller_power (27 pins)
VBAT: Arduino_extension_connectors (CN7.33), STM32_microcontroller_power (C84.2 SB21.2 U6.A8)
VDD_APP: STLink_V3E_PWR (JP9.2 SB32.2), STM32_microcontroller_RF (U3.5 U4.5)
VDD_MCU: STLink_V3E_PWR (5 pins), Arduino_extension_connectors (CN7.5 SB29.1)
VDD_RF: STLink_V3E_PWR (JP2.2 SB28.2), STM32_microcontroller_RF (C35.2 C37.1 SB23.2 U6.A2)
VDD_SYS: STLink_V3E_PWR (JP5.2 SB27.2), STM32_microcontroller_power (11 pins)
VIN: STLink_V3E_PWR (C40.2 C99.2 U8.3), Arduino_extension_connectors (CN6.8 CN7.24)
ARD_D0_RX: STM32_microcontroller_IOs (SB4.2 SB9.1), Arduino_extension_connectors (CN9.1 CN10.37)
ARD_D1_TX: STM32_microcontroller_IOs (SB2.2 SB7.1), Arduino_extension_connectors (CN9.2 CN10.35)
ARD_PB3: STM32_microcontroller_IOs (SB31.2), Arduino_extension_connectors (CN9.4 CN10.31)
FE_CTRL1: STM32_microcontroller_IOs (U6.F3), Arduino_extension_connectors (CN10.2), STM32_microcontroller_RF (R27.1 U3.6 U4.6)
FE_CTRL2: STM32_microcontroller_IOs (U6.E4), Arduino_extension_connectors (CN10.4), STM32_microcontroller_RF (R28.1)
FE_CTRL3: STM32_microcontroller_IOs (U6.D5), Arduino_extension_connectors (CN10.38), STM32_microcontroller_RF (SB18.2)
LED1: STM32_microcontroller_IOs (R36.1 U6.B4), Arduino_extension_connectors (CN10.28)
LED2: STM32_microcontroller_IOs (R35.1 U6.C4), Arduino_extension_connectors (CN10.26)
LED3: STM32_microcontroller_IOs (R34.1 U6.G4), Arduino_extension_connectors (CN10.30)
PA0: STM32_microcontroller_IOs (U6.D6), Arduino_extension_connectors (CN10.1), STM32_microcontroller_power (SB16.2)
PA1: STM32_microcontroller_IOs (U6.G3), Arduino_extension_connectors (CN10.36), STM32_microcontroller_power (R22.2)
PA4: STM32_microcontroller_IOs (U6.J1), Arduino_extension_connectors (CN5.3 CN10.17)
PA5: STM32_microcontroller_IOs (U6.J2), Arduino_extension_connectors (CN5.6 CN10.11)
PA6: STM32_microcontroller_IOs (U6.F4), Arduino_extension_connectors (CN5.5 CN10.13)
PA7: STM32_microcontroller_IOs (U6.H3), Arduino_extension_connectors (CN5.4 CN10.15)
PA8: STM32_microcontroller_IOs (U6.J3), Arduino_extension_connectors (CN10.16)
PA9: STM32_microcontroller_IOs (U6.E5), Arduino_extension_connectors (CN5.2 CN10.19)
PA10: STM32_microcontroller_IOs (U6.C8), Arduino_extension_connectors (CN7.32 CN8.3)
PA11: STM32_microcontroller_IOs (U6.B9), Arduino_extension_connectors (CN5.9 CN10.5)
PA12: STM32_microcontroller_IOs (U6.A9), Arduino_extension_connectors (CN5.10 CN10.3)
PA13: STM32_microcontroller_IOs (U6.B8), STLink_V3E_Module (CN16.4 R11.1 U16.5), Arduino_extension_connectors (CN7.13)
PA14: STM32_microcontroller_IOs (U6.A4), STLink_V3E_Module (CN16.6 R12.1 U16.4), Arduino_extension_connectors (CN7.15)
PA15: STM32_microcontroller_IOs (U6.B3), STLink_V3E_Module (CN16.10 U16.1), Arduino_extension_connectors (CN7.17)
PB0: Arduino_extension_connectors (SB30.2), STM32_microcontroller_RF (SB20.1 U6.F6)
PB1: STM32_microcontroller_IOs (U6.E7), Arduino_extension_connectors (CN7.28 CN8.1)
PB2: STM32_microcontroller_IOs (U6.D8), Arduino_extension_connectors (CN7.30 CN8.2)
PB4: STM32_microcontroller_IOs (U6.C2), Arduino_extension_connectors (CN7.34 CN8.4)
PB5: STM32_microcontroller_IOs (U6.D2), Arduino_extension_connectors (CN9.5 CN10.29)
PB8: STM32_microcontroller_IOs (U6.D3), Arduino_extension_connectors (CN9.6 CN10.27)
PB10: STM32_microcontroller_IOs (U6.H4), Arduino_extension_connectors (CN9.7 CN10.25)
PB12: STM32_microcontroller_IOs (U6.E6), Arduino_extension_connectors (CN9.3 CN10.33)
PB13: STM32_microcontroller_IOs (U6.D7), Arduino_extension_connectors (CN7.38 CN8.6)
PB14: STM32_microcontroller_IOs (U6.C6), Arduino_extension_connectors (CN7.36 CN8.5)
PC0: STM32_microcontroller_IOs (U6.F2), Arduino_extension_connectors (CN10.14)
PC1: STM32_microcontroller_IOs (U6.F1), Arduino_extension_connectors (CN9.8 CN10.23)
PC2: STM32_microcontroller_IOs (U6.D4), Arduino_extension_connectors (CN5.1 CN10.21)
PC6: STM32_microcontroller_IOs (U6.G2), Arduino_extension_connectors (CN10.12), STM32_microcontroller_power (R23.2)
PC13: STM32_microcontroller_IOs (U6.C7), Arduino_extension_connectors (CN7.23), STM32_microcontroller_power (SB15.2)
PC14: STM32_microcontroller_IOs (SB11.1), Arduino_extension_connectors (CN7.25)
PC15: STM32_microcontroller_IOs (SB14.1), Arduino_extension_connectors (CN7.27)
PH3: STM32_microcontroller_IOs (JP3.1 U6.J5), Arduino_extension_connectors (SB19.1)
T_NRST: STM32_microcontroller_IOs (5 pins), STLink_V3E_Module (CN16.12 R15.1 U10.1), Arduino_extension_connectors (CN6.3 CN7.14)
T_SWO: STM32_microcontroller_IOs (SB8.2), STLink_V3E_Module (CN16.8 R13.1 U16.3)
T_VCP_RX: STM32_microcontroller_IOs (SB5.1 SB10.2), STLink_V3E_Module (CN16.13 R17.2 U15.1)
T_VCP_TX: STM32_microcontroller_IOs (SB3.1 SB6.2), STLink_V3E_Module (CN16.14 R16.1 U15.3)

## Assembly variants
Low-band: not fitted C17 C21 C22 C30 C38 C92 C93 C94 C95 C96 C97 C98 C99 C100 C101 CN2 CN11 CN13 HW7 HW8 HW21 JP2 JP5 JP9 R33 R39 R40 R41 SB2 SB4 SB6 SB8 SB10 SB11 SB14 SB15 SB25; alternate parts C6 -> MCD-01781, C5 -> MCD-01781, L7 -> MCD-02074, L8 -> MCD-01771, C25 -> MCD-01604, C24 -> MCD-01604, L9 -> MCD-01937, L10 -> MCD-01937, L11 -> MCD-02069, L3 -> MCD-02067, L4 -> MCD-01770, L5 -> MCD-02077, L6 -> MCD-01936, L2 -> MCD-02067, C2 -> MCD-01604, C7 -> MCD-01374, C8 -> MCD-01374, C12 -> MCD-01604, C13 -> MCD-01604, C11 -> MCD-01933, C14 -> MCD-01933, C15 -> MCD-01778, C16 -> MCD-01776, C78 -> MCD-01604, C80 -> MCD-01604, C82 -> MCD-01604, C19 -> MCD-02066, C20 -> MCD-01776
High-band: not fitted C17 C30 C38 CN2 CN11 CN13 HW7 HW8 HW21 JP2 JP5 JP9 R33 R39 R40 R41 SB2 SB4 SB6 SB8 SB10 SB11 SB14 SB15 SB25; alternate parts L7 -> MCD-02069, L8 -> MCD-01609, C25 -> MCD-01784, C24 -> MCD-01784, L9 -> MCD-01937, L10 -> MCD-02078, L11 -> MCD-01921, L3 -> MCD-01768, L4 -> MCD-01768, L5 -> MCD-01762, L6 -> MCD-01922, L2 -> MCD-01768, C5 -> MCD-01775, C6 -> MCD-01775, C2 -> MCD-01784, C7 -> MCD-02065, C8 -> MCD-01772, C12 -> MCD-01604, C13 -> MCD-01784, C11 -> MCD-01374, C14 -> MCD-01775, C21 -> MCD-01374, C22 -> MCD-02065, C15 -> MCD-01773, C16 -> MCD-01774, C78 -> MCD-01784, C80 -> MCD-01784, C82 -> MCD-01784, C19 -> MCD-01774, C20 -> MCD-01776, C92 -> MCD-02065, C93 -> MCD-01775, C94 -> MCD-02065, C95 -> MCD-02065, C96 -> MCD-02065, C97 -> MCD-02065